# Altium schematic sheet ext_bootload_activation.SchDoc
size A3; DocumentNumber: 10; SheetNumber: 10; SheetTotal: 24; SheetDescription: External Bootload Activation Circuit
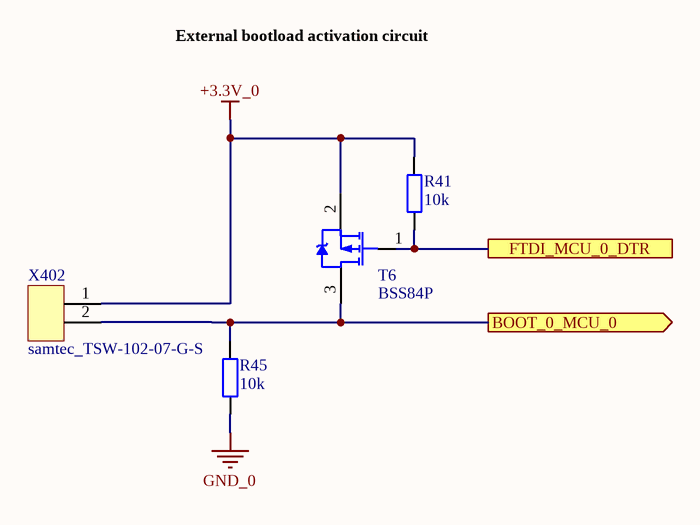
[diagram p0: ext_bootload_activation.SchDoc]

## Parts
R41  10k  [0603R]
R45  10k  [0603R]
T6  BSS84P  [INF-PG-SOT23_N]
X402  samtec_TSW-102-07-G-S  [Pinheader_2.54_2]

## Ports
BOOT_0_MCU_0 (out), FTDI_MCU_0_DTR

## Nets
+3.3V_0: R41.2 T6.2(SOURCE) X402.1
GND_0: R45.1
BOOT_0_MCU_0: R45.2 T6.3(DRAIN) X402.2 ; port BOOT_0_MCU_0
FTDI_MCU_0_DTR: R41.1 T6.1(GATE) ; port FTDI_MCU_0_DTR

## Notes on the sheet
- External bootload activation circuit
- Fraunhofer IISB
- Schottkystr. 10
- developed by:
- 91058 Erlangen
- Germany
- Author
- Project
- License
- Description
- File
- Version
- Release Date
- Sheet
- www.foxbms.org
- www.iisb.fraunhofer.de
- foxBMS Team
- /

## Library data of the parts
R41 R45 = gen_R_10k_0603: SMD Resistor 10k 0603; Tolerance: 1%; Power: 0.1W; Case EIA: 0603; Case Metric: 1608; Maximum Working Voltage: 75V; PnP Package: R_0603; Automotive Qualified: False; Part Number: gen_R_10k_0603; Operating Temperature: -55°C - +155°C; Resistance: 10k; Series: E24, E96; PnP Value: 10k; Supplier 1: Farnell; Supplier Part Number 1: 2073349
T6 = CMP-1099-00028-1: P-Channel SIPMOS Small-Signal-Transistor, -60 V VDS, -0.17 A ID, -55 to 150 degC, PG-SOT23, Reel, Green; Manufacturer: Infineon; VGS(th) (max): -2Â V; VGS(th) (min): -1Â V; VDS (max): -60Â V; Rth: 350Â K/W; Pto t (max): 0.36Â W; ID (max): -0.17Â A; IDpuls (max): -0.68Â A; RDS (on) (max) (@4.5V): 12,000Â mOhm; QG: 1Â nC; Green: TRUE; RDS (on) (max): 8,000Â mOhm; ComponentLink3URL: http://www.infineon.com/dgdl/SOT23-Package_Overview.pdf?folderId=db3a30431936bc4b0119532290053c66&fileId=db3a30431936bc4b0119533468123c85; ComponentLink3Description: Package Specification; Packing: Reel; PartNumber: BSS84P; ComponentLink2Description: Datasheet; Mounting Technology: Surface Mount; ComponentLink2URL: http://www.infineon.com/dgdl/BSS84P_Rev2.7%5B1%5D.pdf?folderId=db3a304314dca38901154a72e3951a65&fileId=db3a304330f68606013118ac7a9b4549; PackageReference: PG-SOT23; ComponentLink1URL: http://www.infineon.com/; PackageVersion: Apr-08; ComponentLink1Description: Manufacturer URL; PackageDescription: 3-Pin Small Outline Transistor Package, 2.9 x 1.3 mm Body, 0.95 mm Pitch; Halogen-free: TRUE; DatasheetVersion: Rev. 2.7
X402 = samtec_TSW-102-07-G-S: Board-To-Board Connector, Vertical, 2.54 mm, 2 Contacts, Header, TSW Series, Through Hole, 1 Row; Manufacturer: Samtec; Circuits: 2; Automotive Qualified: False; Part Number: samtec_TSW-102-07-G-S; Part Name: TSW-102-07-G-S; Operating Temperature: -55°C - +125°C; ComponentLink1Description: Datasheet; ComponentLink1URL: http://www.farnell.com/datasheets/1796313.pdf; Supplier 1: Farnell; Supplier Part Number 1: 2505044